# Altium schematic sheet pca20054_sheet3_antenna_switches.SchDoc: PCA20054 - Antenna Switches
size A2; Organization: Nordic Semiconductor; DocumentNumber: 0; Revision: 1.0.0; SheetNumber: 3; SheetTotal: 5; CompanyName: Nordic Semiconductor; DrawnBy: KJP; DocumentSize: A2; Project Number: 4467
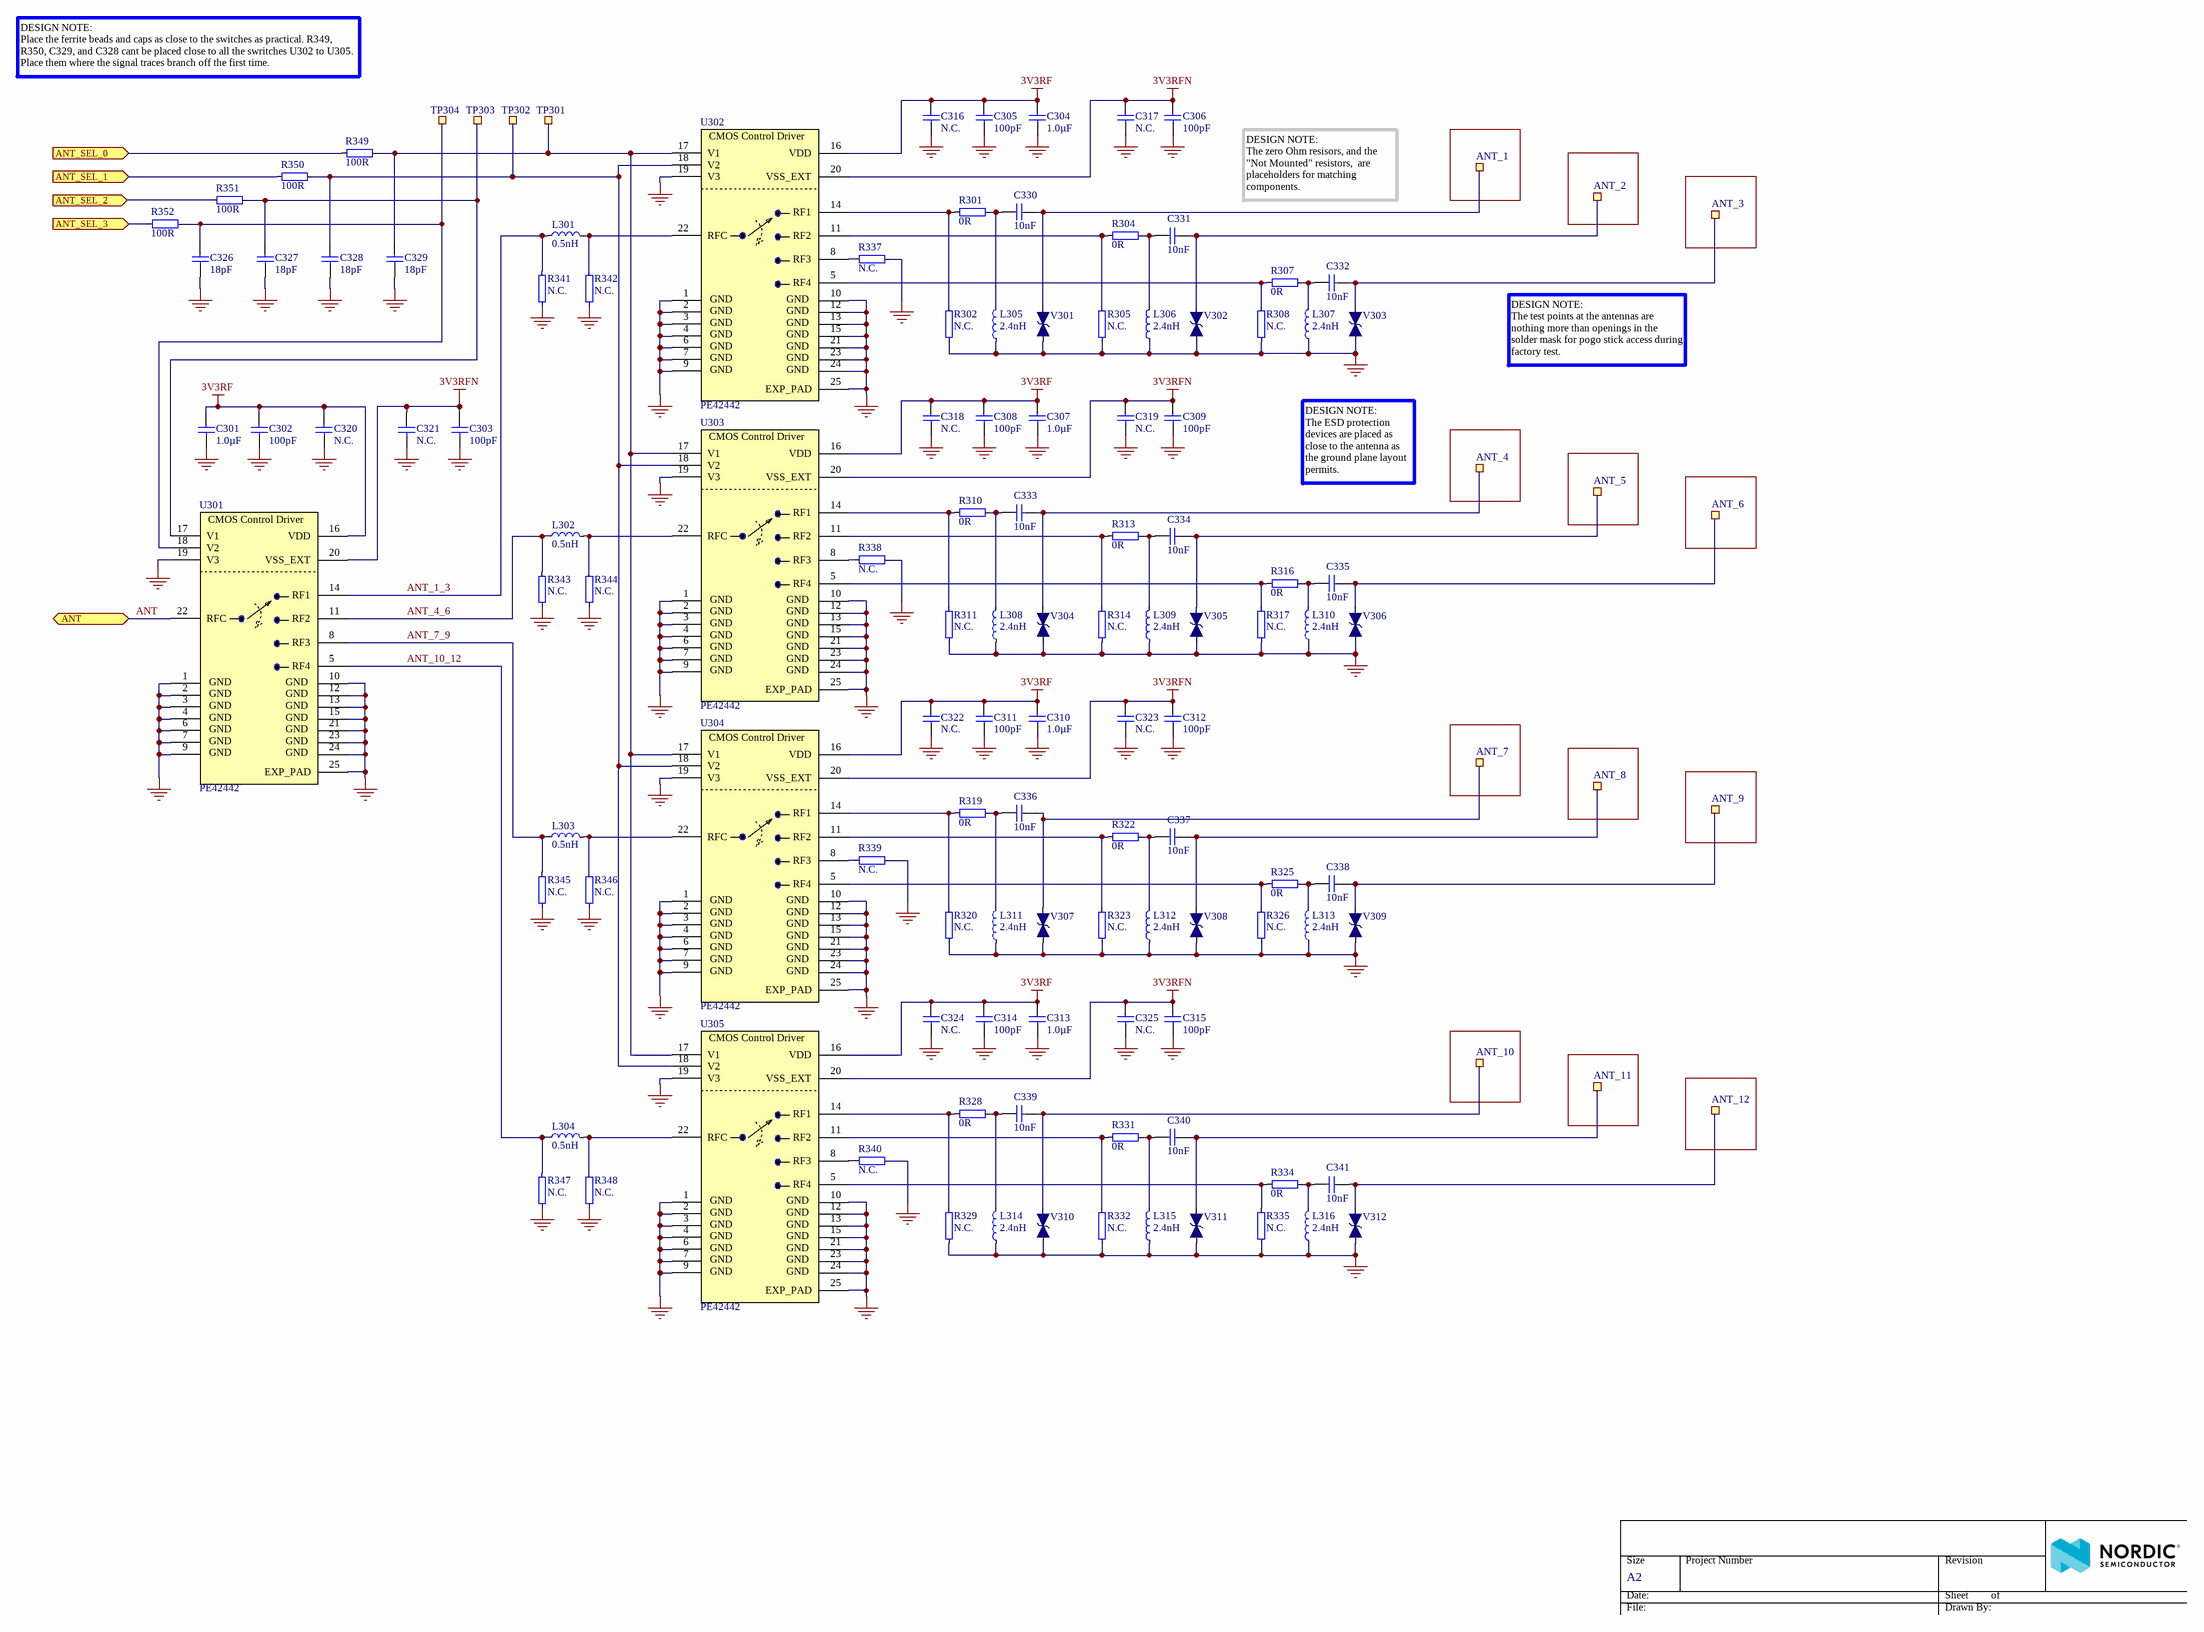
[diagram p0: pca20054_sheet3_antenna_switches.SchDoc]

## Parts
ANT_1  Ø1.0mm,SMD  [TP_SMD_?.0mm]  (value not drawn)  (no BOM)
ANT_2  Ø1.0mm,SMD  [TP_SMD_?.0mm]  (value not drawn)  (no BOM)
ANT_3  Ø1.0mm,SMD  [TP_SMD_?.0mm]  (value not drawn)  (no BOM)
ANT_4  Ø1.0mm,SMD  [TP_SMD_?.0mm]  (value not drawn)  (no BOM)
ANT_5  Ø1.0mm,SMD  [TP_SMD_?.0mm]  (value not drawn)  (no BOM)
ANT_6  Ø1.0mm,SMD  [TP_SMD_?.0mm]  (value not drawn)  (no BOM)
ANT_7  Ø1.0mm,SMD  [TP_SMD_?.0mm]  (value not drawn)  (no BOM)
ANT_8  Ø1.0mm,SMD  [TP_SMD_?.0mm]  (value not drawn)  (no BOM)
ANT_9  Ø1.0mm,SMD  [TP_SMD_?.0mm]  (value not drawn)  (no BOM)
ANT_10  Ø1.0mm,SMD  [TP_SMD_?.0mm]  (value not drawn)  (no BOM)
ANT_11  Ø1.0mm,SMD  [TP_SMD_?.0mm]  (value not drawn)  (no BOM)
ANT_12  Ø1.0mm,SMD  [TP_SMD_?.0mm]  (value not drawn)  (no BOM)
C301  1.0µF  [CAPC1608X06L]
C302  100pF  [CAPC1005X04L]
C303  100pF  [CAPC1005X04L]
C304  1.0µF  [CAPC1608X06L]
C305  100pF  [CAPC1005X04L]
C306  100pF  [CAPC1005X04L]
C307  1.0µF  [CAPC1608X06L]
C308  100pF  [CAPC1005X04L]
C309  100pF  [CAPC1005X04L]
C310  1.0µF  [CAPC1608X06L]
C311  100pF  [CAPC1005X04L]
C312  100pF  [CAPC1005X04L]
C313  1.0µF  [CAPC1608X06L]
C314  100pF  [CAPC1005X04L]
C315  100pF  [CAPC1005X04L]
C316  N.C.  [CAPC1005X04L_NC]
C317  N.C.  [CAPC1005X04L_NC]
C318  N.C.  [CAPC1005X04L_NC]
C319  N.C.  [CAPC1005X04L_NC]
C320  N.C.  [CAPC1005X04L_NC]
C321  N.C.  [CAPC1005X04L_NC]
C322  N.C.  [CAPC1005X04L_NC]
C323  N.C.  [CAPC1005X04L_NC]
C324  N.C.  [CAPC1005X04L_NC]
C325  N.C.  [CAPC1005X04L_NC]
C326  18pF  [CAPC1005X04L]
C327  18pF  [CAPC1005X04L]
C328  18pF  [CAPC1005X04L]
C329  18pF  [CAPC1005X04L]
C330  10nF  [CAPC1005X04L]
C331  10nF  [CAPC1005X04L]
C332  10nF  [CAPC1005X04L]
C333  10nF  [CAPC1005X04L]
C334  10nF  [CAPC1005X04L]
C335  10nF  [CAPC1005X04L]
C336  10nF  [CAPC1005X04L]
C337  10nF  [CAPC1005X04L]
C338  10nF  [CAPC1005X04L]
C339  10nF  [CAPC1005X04L]
C340  10nF  [CAPC1005X04L]
C341  10nF  [CAPC1005X04L]
L301  0.5nH  [INDC1005X04L]
L302  0.5nH  [INDC1005X04L]
L303  0.5nH  [INDC1005X04L]
L304  0.5nH  [INDC1005X04L]
L305  2.4nH  [INDC1005X04L]
L306  2.4nH  [INDC1005X04L]
L307  2.4nH  [INDC1005X04L]
L308  2.4nH  [INDC1005X04L]
L309  2.4nH  [INDC1005X04L]
L310  2.4nH  [INDC1005X04L]
L311  2.4nH  [INDC1005X04L]
L312  2.4nH  [INDC1005X04L]
L313  2.4nH  [INDC1005X04L]
L314  2.4nH  [INDC1005X04L]
L315  2.4nH  [INDC1005X04L]
L316  2.4nH  [INDC1005X04L]
R301  0R  [RESC1005X04L]
R302  N.C.  [RESC1005X04L_NC]
R304  0R  [RESC1005X04L]
R305  N.C.  [RESC1005X04L_NC]
R307  0R  [RESC1005X04L]
R308  N.C.  [RESC1005X04L_NC]
R310  0R  [RESC1005X04L]
R311  N.C.  [RESC1005X04L_NC]
R313  0R  [RESC1005X04L]
R314  N.C.  [RESC1005X04L_NC]
R316  0R  [RESC1005X04L]
R317  N.C.  [RESC1005X04L_NC]
R319  0R  [RESC1005X04L]
R320  N.C.  [RESC1005X04L_NC]
R322  0R  [RESC1005X04L]
R323  N.C.  [RESC1005X04L_NC]
R325  0R  [RESC1005X04L]
R326  N.C.  [RESC1005X04L_NC]
R328  0R  [RESC1005X04L]
R329  N.C.  [RESC1005X04L_NC]
R331  0R  [RESC1005X04L]
R332  N.C.  [RESC1005X04L_NC]
R334  0R  [RESC1005X04L]
R335  N.C.  [RESC1005X04L_NC]
R337  N.C.  [RESC1005X04L_NC]
R338  N.C.  [RESC1005X04L_NC]
R339  N.C.  [RESC1005X04L_NC]
R340  N.C.  [RESC1005X04L_NC]
R341  N.C.  [RESC1005X04L_NC]
R342  N.C.  [RESC1005X04L_NC]
R343  N.C.  [RESC1005X04L_NC]
R344  N.C.  [RESC1005X04L_NC]
R345  N.C.  [RESC1005X04L_NC]
R346  N.C.  [RESC1005X04L_NC]
R347  N.C.  [RESC1005X04L_NC]
R348  N.C.  [RESC1005X04L_NC]
R349  100R  [RESC1005X04L]
R350  100R  [RESC1005X04L]
R351  100R  [RESC1005X04L]
R352  100R  [RESC1005X04L]
TP301  Ø1.0mm,SMD  [TP_SMD_?.0mm]  (value not drawn)  (no BOM)
TP302  Ø1.0mm,SMD  [TP_SMD_?.0mm]  (value not drawn)  (no BOM)
TP303  Ø1.0mm,SMD  [TP_SMD_?.0mm]  (value not drawn)  (no BOM)
TP304  Ø1.0mm,SMD  [TP_SMD_?.0mm]  (value not drawn)  (no BOM)
U301  PE42442  [QFN50P400X400X80_HS-25N]
U302  PE42442  [QFN50P400X400X80_HS-25N]
U303  PE42442  [QFN50P400X400X80_HS-25N]
U304  PE42442  [QFN50P400X400X80_HS-25N]
U305  PE42442  [QFN50P400X400X80_HS-25N]
V301  LXES15AAA1-133  [RESC1005X04L]  (value not drawn)
V302  LXES15AAA1-133  [RESC1005X04L]  (value not drawn)
V303  LXES15AAA1-133  [RESC1005X04L]  (value not drawn)
V304  LXES15AAA1-133  [RESC1005X04L]  (value not drawn)
V305  LXES15AAA1-133  [RESC1005X04L]  (value not drawn)
V306  LXES15AAA1-133  [RESC1005X04L]  (value not drawn)
V307  LXES15AAA1-133  [RESC1005X04L]  (value not drawn)
V308  LXES15AAA1-133  [RESC1005X04L]  (value not drawn)
V309  LXES15AAA1-133  [RESC1005X04L]  (value not drawn)
V310  LXES15AAA1-133  [RESC1005X04L]  (value not drawn)
V311  LXES15AAA1-133  [RESC1005X04L]  (value not drawn)
V312  LXES15AAA1-133  [RESC1005X04L]  (value not drawn)

## Ports
ANT (bidir), ANT_SEL_0 (in), ANT_SEL_1 (in), ANT_SEL_2 (in), ANT_SEL_3 (in)

## Nets
3V3RF: C301.2 C302.2 C304.2 C305.2 C307.2 C308.2 C310.2 C311.2 C313.2 C314.2 C316.2 C318.2 C320.2 C322.2 C324.2 U301.16(VDD) U302.16(VDD) U303.16(VDD) U304.16(VDD) U305.16(VDD)
3V3RFN: C303.2 C306.2 C309.2 C312.2 C315.2 C317.2 C319.2 C321.2 C323.2 C325.2 U301.20(VSS_EXT) U302.20(VSS_EXT) U303.20(VSS_EXT) U304.20(VSS_EXT) U305.20(VSS_EXT)
GND: C301.1 C302.1 C303.1 C304.1 C305.1 C306.1 C307.1 C308.1 C309.1 C310.1 C311.1 C312.1 C313.1 C314.1 C315.1 C316.1 C317.1 C318.1 C319.1 C320.1 C321.1 C322.1 C323.1 C324.1 C325.1 C326.1 C327.1 C328.1 C329.1 L305.1 L306.1 L307.1 L308.1 L309.1 L310.1 L311.1 L312.1 L313.1 L314.1 L315.1 L316.1 R302.1 R305.1 R308.1 R311.1 R314.1 R317.1 R320.1 R323.1 R326.1 R329.1 R332.1 R335.1 R337.2 R338.2 R339.2 R340.2 R341.1 R342.1 R343.1 R344.1 R345.1 R346.1 R347.1 R348.1 U301.1(GND1) U301.2(GND2) U301.3(GND3) U301.4(GND4) U301.6(GND5) U301.7(GND6) U301.9(GND7) U301.10(GND8) U301.12(GND9) U301.13(GND10) U301.15(GND11) U301.19(V3) U301.21(GND12) U301.23(GND14) U301.24(GND13) U301.25(EXP_PAD) U302.1(GND1) U302.2(GND2) U302.3(GND3) U302.4(GND4) U302.6(GND5) U302.7(GND6) U302.9(GND7) U302.10(GND8) U302.12(GND9) U302.13(GND10) U302.15(GND11) U302.19(V3) U302.21(GND12) U302.23(GND14) U302.24(GND13) U302.25(EXP_PAD) U303.1(GND1) U303.2(GND2) U303.3(GND3) U303.4(GND4) U303.6(GND5) U303.7(GND6) U303.9(GND7) U303.10(GND8) U303.12(GND9) U303.13(GND10) U303.15(GND11) U303.19(V3) U303.21(GND12) U303.23(GND14) U303.24(GND13) U303.25(EXP_PAD) U304.1(GND1) U304.2(GND2) U304.3(GND3) U304.4(GND4) U304.6(GND5) U304.7(GND6) U304.9(GND7) U304.10(GND8) U304.12(GND9) U304.13(GND10) U304.15(GND11) U304.19(V3) U304.21(GND12) U304.23(GND14) U304.24(GND13) U304.25(EXP_PAD) U305.1(GND1) U305.2(GND2) U305.3(GND3) U305.4(GND4) U305.6(GND5) U305.7(GND6) U305.9(GND7) U305.10(GND8) U305.12(GND9) U305.13(GND10) U305.15(GND11) U305.19(V3) U305.21(GND12) U305.23(GND14) U305.24(GND13) U305.25(EXP_PAD) V301.2 V302.2 V303.2 V304.2 V305.2 V306.2 V307.2 V308.2 V309.2 V310.2 V311.2 V312.2
ANT: U301.22(RFC) ; port ANT
ANT_1_3: L301.1 R341.2 U301.14(RF1)
ANT_4_6: L302.1 R343.2 U301.11(RF2)
ANT_7_9: L303.1 R345.2 U301.8(RF3)
ANT_10_12: L304.1 R347.2 U301.5(RF4)
ANT_SEL_0: R349.1 ; port ANT_SEL_0
ANT_SEL_1: R350.1 ; port ANT_SEL_1
ANT_SEL_2: R351.1 ; port ANT_SEL_2
ANT_SEL_3: R352.1 ; port ANT_SEL_3
NetANT_1_1: ANT_1.1 C330.2 V301.1
NetANT_2_1: ANT_2.1 C331.2 V302.1
NetANT_3_1: ANT_3.1 C332.2 V303.1
NetANT_4_1: ANT_4.1 C333.2 V304.1
NetANT_5_1: ANT_5.1 C334.2 V305.1
NetANT_6_1: ANT_6.1 C335.2 V306.1
NetANT_7_1: ANT_7.1 C336.2 V307.1
NetANT_8_1: ANT_8.1 C337.2 V308.1
NetANT_9_1: ANT_9.1 C338.2 V309.1
NetANT_10_1: ANT_10.1 C339.2 V310.1
NetANT_11_1: ANT_11.1 C340.2 V311.1
NetANT_12_1: ANT_12.1 C341.2 V312.1
NetC326_2: C326.2 R352.2 TP304.1 U301.18(V2)
NetC327_2: C327.2 R351.2 TP303.1 U301.17(V1)
NetC328_2: C328.2 R350.2 TP302.1 U302.18(V2) U303.18(V2) U304.18(V2) U305.18(V2)
NetC329_2: C329.2 R349.2 TP301.1 U302.17(V1) U303.17(V1) U304.17(V1) U305.17(V1)
NetC330_1: C330.1 L305.2 R301.2
NetC331_1: C331.1 L306.2 R304.2
NetC332_1: C332.1 L307.2 R307.2
NetC333_1: C333.1 L308.2 R310.2
NetC334_1: C334.1 L309.2 R313.2
NetC335_1: C335.1 L310.2 R316.2
NetC336_1: C336.1 L311.2 R319.2
NetC337_1: C337.1 L312.2 R322.2
NetC338_1: C338.1 L313.2 R325.2
NetC339_1: C339.1 L314.2 R328.2
NetC340_1: C340.1 L315.2 R331.2
NetC341_1: C341.1 L316.2 R334.2
NetL301_2: L301.2 R342.2 U302.22(RFC)
NetL302_2: L302.2 R344.2 U303.22(RFC)
NetL303_2: L303.2 R346.2 U304.22(RFC)
NetL304_2: L304.2 R348.2 U305.22(RFC)
NetR301_1: R301.1 R302.2 U302.14(RF1)
NetR304_1: R304.1 R305.2 U302.11(RF2)
NetR307_1: R307.1 R308.2 U302.5(RF4)
NetR310_1: R310.1 R311.2 U303.14(RF1)
NetR313_1: R313.1 R314.2 U303.11(RF2)
NetR316_1: R316.1 R317.2 U303.5(RF4)
NetR319_1: R319.1 R320.2 U304.14(RF1)
NetR322_1: R322.1 R323.2 U304.11(RF2)
NetR325_1: R325.1 R326.2 U304.5(RF4)
NetR328_1: R328.1 R329.2 U305.14(RF1)
NetR331_1: R331.1 R332.2 U305.11(RF2)
NetR334_1: R334.1 R335.2 U305.5(RF4)
NetR337_1: R337.1 U302.8(RF3)
NetR338_1: R338.1 U303.8(RF3)
NetR339_1: R339.1 U304.8(RF3)
NetR340_1: R340.1 U305.8(RF3)

## Notes on the sheet
- DESIGN NOTE:
  Place the ferrite beads and caps as close to the switches as practical. R349, R350, C329, and C328 cant be placed close to all the swritches U302 to U305. Place them where the signal traces branch off the first time.
- DESIGN NOTE:
  The zero Ohm resisors, and the "Not Mounted" resistors,  are placeholders for matching components.
- DESIGN NOTE:
  The test points at the antennas are nothing more than openings in the solder mask for pogo stick access during factory test.
- DESIGN NOTE:
  The ESD protection devices are placed as close to the antenna as the ground plane layout permits.
- Size
- Date:
- File:
- A2
- Project Number
- Sheet         of
- Drawn By:
- Revision
- (in symbol PE42442) CMOS Control Driver; GND

## Library data of the parts
ANT_1-ANT_12 TP301-TP304 = TP_SMD_Ø1.0MM: 1.0mm circular SMD testpad; Manufacturer: Nordic Semiconductor; Artikkelnr Noca: N.A.; Part Number: TP_SMD_Ø1.0MM; Manufacturer Part Number: *; ComponentLink1URL: *; ComponentLink1Description: Datasheet; ComponentLink2URL: *; ComponentLink2Description: Supplier link; HelpURL: *; Footprint Doc: TP_SMD_Ø1.0mm; LatestRevisionDate: 2013-06-11; Pin Count: 1; Publisher: Nordic Semiconductor; Published: 2013-06-11; Value: Ø1.0mm,SMD; Note: *; Supplier 1: *; Supplier Part Number 1: *; Supplier 2: *; Supplier Part Number 2: *; Part number IPS: N.A.
C301 C304 C307 C310 C313 = C0603-1µ0: Capacitor, X7R, ±10%; Part number IPS: 00000000616; Note: 16V; Artikkelnr Noca: 20039282; Part Number: C0603-1µ0; Manufacturer: *; Manufacturer Part Number: *; ComponentLink1URL: *; ComponentLink1Description: Datasheet; ComponentLink2URL: *; ComponentLink2Description: Supplier link; HelpURL: *; Footprint Doc: 0603; LatestRevisionDate: 2013-06-05; Pin Count: 2; Publisher: Nordic Semiconductor; Published: 2009-05-08; Value: 1.0µF; Supplier 1: *; Supplier Part Number 1: *; Supplier 2: *; Supplier Part Number 2: *
C302 C303 C305 C306 C308 C309 C311 C312 C314 C315 = C0402-100p: Capacitor, NP0, ±5%; Part number IPS: 00000002361; Note: 50V; Artikkelnr Noca: 20029135; Part Number: C0402-100p; Manufacturer: *; Manufacturer Part Number: *; ComponentLink1URL: *; ComponentLink1Description: Datasheet; ComponentLink2URL: *; ComponentLink2Description: Supplier link; HelpURL: *; Footprint Doc: 0402; LatestRevisionDate: 2009-05-08; Pin Count: 2; Publisher: Nordic Semiconductor; Published: 2009-05-08; Value: 100pF; Supplier 1: *; Supplier Part Number 1: *; Supplier 2: *; Supplier Part Number 2: *
C316-C325 = C0402-N.C.: Not mounted; Assembly: Not mounted; Note: Chip Cap; Artikkelnr Noca: N.A.; Part Number: C0402-N.C.; Manufacturer: *; Manufacturer Part Number: *; ComponentLink1URL: *; ComponentLink1Description: Datasheet; ComponentLink2URL: *; ComponentLink2Description: Supplier link; HelpURL: *; Footprint Doc: 0402; LatestRevisionDate: 2009-05-08; Pin Count: 2; Publisher: Nordic Semiconductor; Published: 2009-05-08; Value: N.C.; Supplier 1: *; Supplier Part Number 1: *; Supplier 2: *; Supplier Part Number 2: *; Part number IPS: N.A.
C326-C329 = C0402-18p: Capacitor, NP0, ±5%; Part number IPS: N.A.; Note: 50V; Artikkelnr Noca: 20029209; Part Number: C0402-18p; Manufacturer: *; Manufacturer Part Number: *; ComponentLink1URL: *; ComponentLink1Description: Datasheet; ComponentLink2URL: *; ComponentLink2Description: Supplier link; HelpURL: *; Footprint Doc: 0402; LatestRevisionDate: 2009-05-08; Pin Count: 2; Publisher: Nordic Semiconductor; Published: 2009-05-08; Value: 18pF; Supplier 1: *; Supplier Part Number 1: *; Supplier 2: *; Supplier Part Number 2: *
C330-C341 = C0402-10n: Capacitor, X7R, ±10%; Part number IPS: 00000007784; Note: 16V; Artikkelnr Noca: 20039166; Part Number: C0402-10n; Manufacturer: *; Manufacturer Part Number: *; ComponentLink1URL: *; ComponentLink1Description: Datasheet; ComponentLink2URL: *; ComponentLink2Description: Supplier link; HelpURL: *; Footprint Doc: 0402; LatestRevisionDate: 2009-11-23; Pin Count: 2; Publisher: Nordic Semiconductor; Published: 2009-05-08; Value: 10nF; Supplier 1: *; Supplier Part Number 1: *; Supplier 2: *; Supplier Part Number 2: *
L301-L304 = L0402-0n5: Inductor, 1A, ±0.1nH; Manufacturer: TDK Corporation; Manufacturer Part Number: MLG1005S0N5BT000; Note: High frequency chip inductor ±0.1nH; Artikkelnr Noca: N.A.; Part Number: L0402-0n5; ComponentLink1URL: *; ComponentLink1Description: Datasheet; ComponentLink2URL: https://product.tdk.com/info/en/catalog/datasheets/inductor_commercial_high-frequency_mlg1005s_en.pdf?ref_disty=digikey; ComponentLink2Description: Supplier link; HelpURL: *; Footprint Doc: 0402; LatestRevisionDate: 2012-09-19; Pin Count: 2; Publisher: Nordic Semiconductor; Published: 2009-05-08; Value: 0.5nH; Supplier 1: Digi-Key; Supplier Part Number 1: 445-16235-1-ND; Supplier 2: *; Supplier Part Number 2: *; Part number IPS: N.A.
L305-L316 = L0402-2n4: Inductor, 220mA, ±0.1nH; Part number IPS: N.A.; Note: High frequency chip inductor ±5%; Part Number: L0402-2n4; Manufacturer: *; Manufacturer Part Number: *; ComponentLink1URL: *; ComponentLink1Description: Datasheet; ComponentLink2URL: *; ComponentLink2Description: Supplier link; HelpURL: *; Footprint Doc: 0402; LatestRevisionDate: 2012-09-19; Pin Count: 2; Publisher: Nordic Semiconductor; Published: 2009-05-08; Value: 2.4nH; Supplier 1: *; Supplier Part Number 1: *; Supplier 2: *; Supplier Part Number 2: *; Artikkelnr Noca: *
R301 R304 R307 R310 R313 R316 R319 R322 R325 R328 R331 R334 = R0402-0R: Resistor, ±5%, 0.063W; Part number IPS: 00000007128; Note: Chip Res 5%; Artikkelnr Noca: 27049000; Part Number: R0402-0R; Manufacturer: *; Manufacturer Part Number: *; ComponentLink1URL: *; ComponentLink1Description: Datasheet; ComponentLink2URL: *; ComponentLink2Description: Supplier link; HelpURL: *; Footprint Doc: 0402; LatestRevisionDate: 2009-11-23; Pin Count: 2; Publisher: Nordic Semiconductor; Published: 2009-05-08; Value: 0R; Supplier 1: Farnell; Supplier Part Number 1: 146-9661; Supplier 2: *; Supplier Part Number 2: *
R302 R305 R308 R311 R314 R317 R320 R323 R326 R329 R332 R335 R337-R348 = R0402-N.C.: Not mounted; Assembly: Not mounted; Note: Chip Res; Artikkelnr Noca: N.A.; Part Number: R0402-N.C.; Manufacturer: *; Manufacturer Part Number: *; ComponentLink1URL: *; ComponentLink1Description: Datasheet; ComponentLink2URL: *; ComponentLink2Description: Supplier link; HelpURL: *; Footprint Doc: 0402; LatestRevisionDate: 2009-05-08; Pin Count: 2; Publisher: Nordic Semiconductor; Published: 2009-05-08; Value: N.C.; Supplier 1: *; Supplier Part Number 1: *; Supplier 2: *; Supplier Part Number 2: *; Part number IPS: N.A.
R349-R352 = R0402-100: Resistor, ±1%, 0.063W; Part number IPS: 00000002811; Note: Chip Res 1%; Artikkelnr Noca: 27049049; Part Number: R0402-100; Manufacturer: *; Manufacturer Part Number: *; ComponentLink1URL: *; ComponentLink1Description: Datasheet; ComponentLink2URL: *; ComponentLink2Description: Supplier link; HelpURL: *; Footprint Doc: 0402; LatestRevisionDate: 2009-11-23; Pin Count: 2; Publisher: Nordic Semiconductor; Published: 2009-05-08; Value: 100R; Supplier 1: Farnell; Supplier Part Number 1: 173-8837; Supplier 2: *; Supplier Part Number 2: *
U301-U305 = PE42442: UltraCMOS SP4T RF Switch 30 MHz-6 GHz; Manufacturer: Peregrine Semiconductors; Artikkelnr Noca: N.A.; Part Number: PE42442; Manufacturer Part Number: PE42442; ComponentLink1URL: http://www.psemi.com/pdf/datasheets/pe42442ds.pdf; ComponentLink1Description: Datasheet; ComponentLink2URL: https://www.digikey.com/product-detail/en/psemi/PE42442A-Z/1046-1096-1-ND/4747404; ComponentLink2Description: Supplier link; HelpURL: https://www.psemi.com/products/rf-switches/pe42442; Footprint Doc: QFN-24; LatestRevisionDate: 2020-01-17; Pin Count: 5; Publisher: Nordic Semiconductor; Published: 2020-01-17; Value: PE42442; Note: *; Supplier 1: Digi-Key; Supplier Part Number 1: 1046-1096-1-ND; Supplier 2: *; Supplier Part Number 2: *; Part number IPS: N.A.
V301-V312 = LXES15AAA1-133: TVS DIODE 15VWM 0402; Manufacturer: Murata; Artikkelnr Noca: N.A.; Part Number: LXES15AAA1-133; Manufacturer Part Number: LXES15AAA1-133; ComponentLink1URL: *; ComponentLink1Description: Datasheet; ComponentLink2URL: *; ComponentLink2Description: Supplier link; HelpURL: http://www.murata.com/en-us/products/productdata/8796832759838/CRESD-E.pdf; Footprint Doc: 0402; LatestRevisionDate: 2017-09-20; Pin Count: 2; Publisher: Nordic Semiconductor; Published: 2017-09-20; Value: LXES15AAA1-133; Note: *; Supplier 1: Digi-Key; Supplier Part Number 1: 490-13209-6-ND; Supplier 2: Mouser; Supplier Part Number 2: 81-LXES15AAA1-133; Part number IPS: N.A.